# EAGLE schematic M215A (EAGLE 6.6.0)
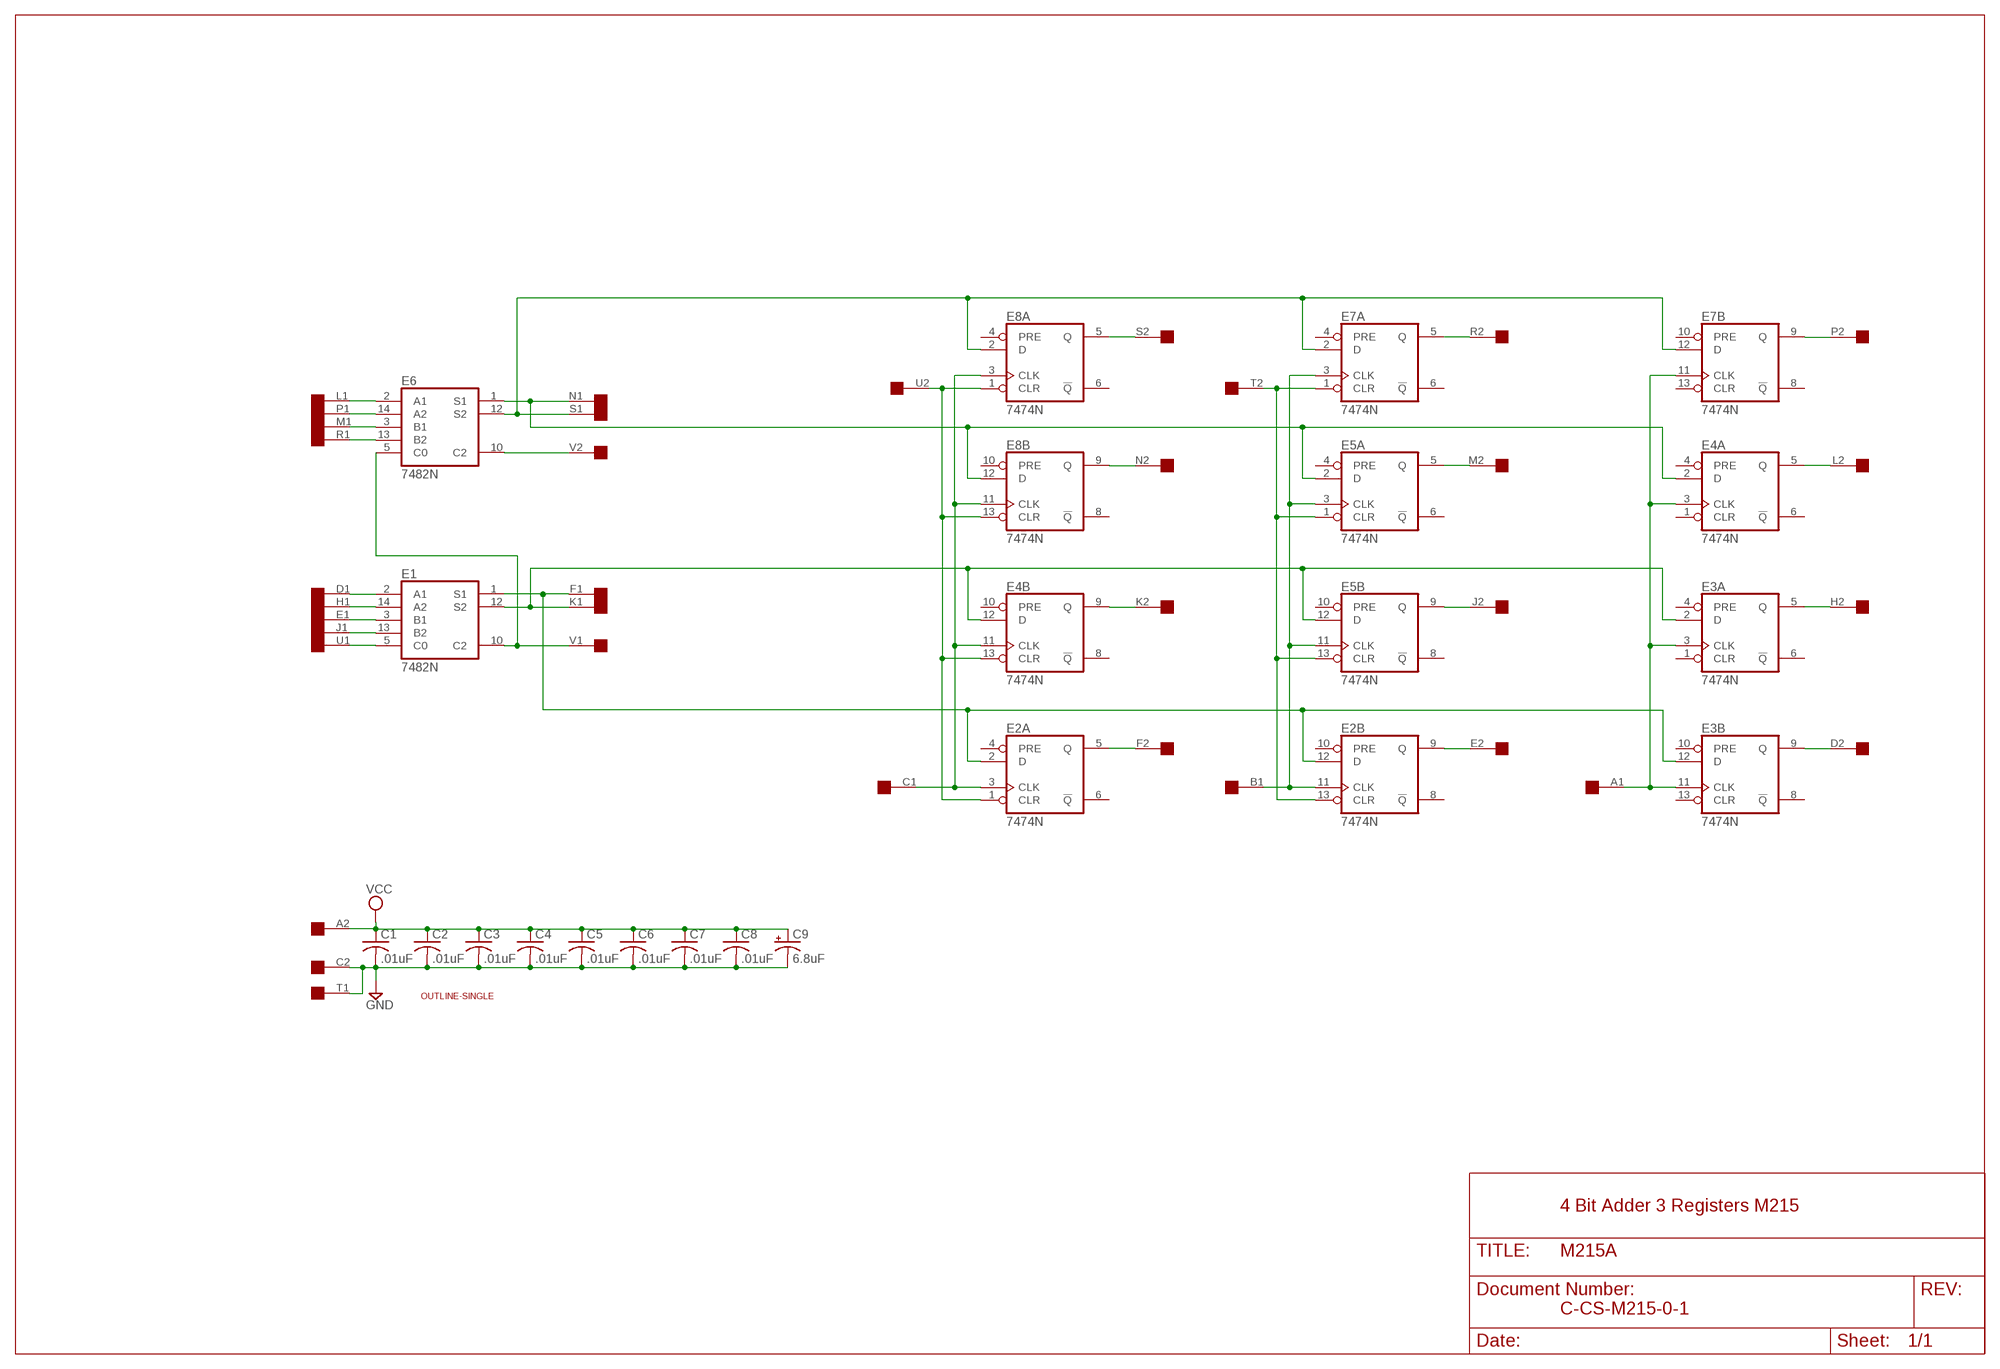
[diagram p0: schematic, sheet 1]

## Parts
C1  .01uF  C-US050-025X075  [C050-025X075]
C2  .01uF  C-US050-025X075  [C050-025X075]
C3  .01uF  C-US050-025X075  [C050-025X075]
C4  .01uF  C-US050-025X075  [C050-025X075]
C5  .01uF  C-US050-025X075  [C050-025X075]
C6  .01uF  C-US050-025X075  [C050-025X075]
C7  .01uF  C-US050-025X075  [C050-025X075]
C8  .01uF  C-US050-025X075  [C050-025X075]
C9  6.8uF  CPOL-USE20-8AXIAL  [E12-8]
E1  7482N  [DIL14]
E2  7474N  74S74N  [DIL14]
E3  7474N  74S74N  [DIL14]
E4  7474N  74S74N  [DIL14]
E5  7474N  74S74N  [DIL14]
E6  7482N  [DIL14]
E7  7474N  74S74N  [DIL14]
E8  7474N  74S74N  [DIL14]
U$1  OUTLINE-SINGLE  [SINGLE]
U$2  SINGLE  [EDGE-CON2]

## Nets
A1: E3.3(A:CLK) E3.11(B:CLK) E4.3(A:CLK) E7.11(B:CLK) U$2.A1
B1: E2.11(B:CLK) E5.3(A:CLK) E5.11(B:CLK) E7.3(A:CLK) U$2.B1
C1: E2.3(A:CLK) E4.11(B:CLK) E8.3(A:CLK) E8.11(B:CLK) U$2.C1
D1: E1.2(A1) U$2.D1
D2: E3.9(B:Q) U$2.D2
E1: E1.3(B1) U$2.E1
E2: E2.9(B:Q) U$2.E2
F1: E1.1(S1) E2.2(A:D) E2.12(B:D) E3.12(B:D) U$2.F1
F2: E2.5(A:Q) U$2.F2
GND [supply]: C1.2 C2.2 C3.2 C4.2 C5.2 C6.2 C7.2 C8.2 C9.- U$2.C2 U$2.T1
H1: E1.14(A2) U$2.H1
H2: E3.5(A:Q) U$2.H2
J1: E1.13(B2) U$2.J1
J2: E5.9(B:Q) U$2.J2
K1: E1.12(S2) E3.2(A:D) E4.12(B:D) E5.12(B:D) U$2.K1
K2: E4.9(B:Q) U$2.K2
L1: E6.2(A1) U$2.L1
L2: E4.5(A:Q) U$2.L2
M1: E6.3(B1) U$2.M1
M2: E5.5(A:Q) U$2.M2
N1: E4.2(A:D) E5.2(A:D) E6.1(S1) E8.12(B:D) U$2.N1
N2: E8.9(B:Q) U$2.N2
P1: E6.14(A2) U$2.P1
P2: E7.9(B:Q) U$2.P2
R1: E6.13(B2) U$2.R1
R2: E7.5(A:Q) U$2.R2
S1: E6.12(S2) E7.2(A:D) E7.12(B:D) E8.2(A:D) U$2.S1
S2: E8.5(A:Q) U$2.S2
T2: E2.13(B:CLR) E5.1(A:CLR) E5.13(B:CLR) E7.1(A:CLR) U$2.T2
U1: E1.5(C0) U$2.U1
U2: E2.1(A:CLR) E4.13(B:CLR) E8.1(A:CLR) E8.13(B:CLR) U$2.U2
V1: E1.10(C2) E6.5(C0) U$2.V1
V2: E6.10(C2) U$2.V2
VCC [supply]: C1.1 C2.1 C3.1 C4.1 C5.1 C6.1 C7.1 C8.1 C9.+ U$2.A2
Unconnected: E1.6 E1.7 E1.8 E1.9 E2.4(A:PRE) E2.6(A:!Q) E2.8(B:!Q) E2.10(B:PRE) E3.1(A:CLR) E3.4(A:PRE) E3.6(A:!Q) E3.8(B:!Q) E3.10(B:PRE) E3.13(B:CLR) E4.1(A:CLR) E4.4(A:PRE) E4.6(A:!Q) E4.8(B:!Q) E4.10(B:PRE) E5.4(A:PRE) E5.6(A:!Q) E5.8(B:!Q) E5.10(B:PRE) E6.6 E6.7 E6.8 E6.9 E7.4(A:PRE) E7.6(A:!Q) E7.8(B:!Q) E7.10(B:PRE) E7.13(B:CLR) E8.4(A:PRE) E8.6(A:!Q) E8.8(B:!Q) E8.10(B:PRE) U$2.B2

## Notes on the sheet
- 4 Bit Adder 3 Registers M215
- C-CS-M215-0-1

## Power pins joined to a net without a drawn wire
GND: E1.11(GND) E2.7(P:GND) E3.7(P:GND) E4.7(P:GND) E5.7(P:GND) E6.11(GND) E7.7(P:GND) E8.7(P:GND)
VCC: E1.4(VCC) E2.14(P:VCC) E3.14(P:VCC) E4.14(P:VCC) E5.14(P:VCC) E6.4(VCC) E7.14(P:VCC) E8.14(P:VCC)

## Library data of the parts
C1-C8 = rcl:C-US: CAPACITOR, American symbol
C9 = dec-con:CPOL-USE20-8AXIAL: A 0.8 inch electrolytic.
E1 E6 = dec-con:74*82: 2-bit binary full ADDER Has the wrong GND pin in other libraries.
E2-E5 E7 E8 = 74xx-us:74*74: Dual D type positive edge triggered FLIP FLOP, preset and clear
U$1 = dec-con:OUTLINE-*: Board outlines for DEC boards.
U$2 = dec-con:SINGLE: Single-Height DEC board

## Net classes
1 supply: width 0.813 mm